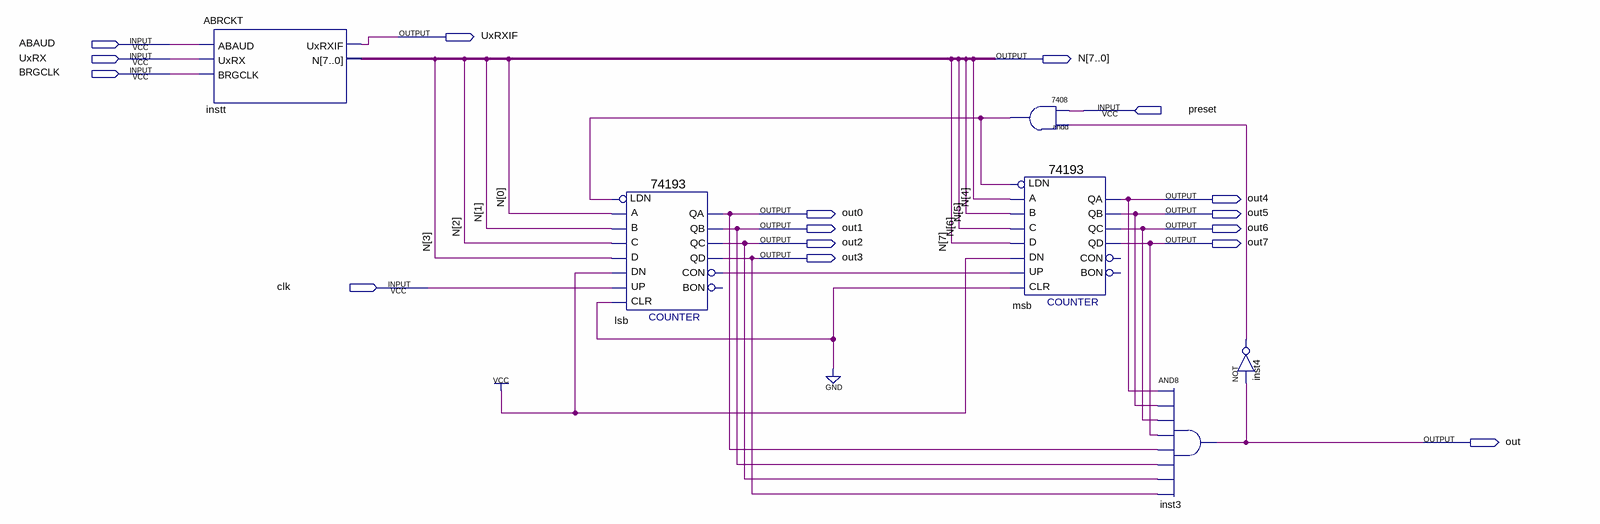
[diagram p0: schematic sheet]
// Quartus schematic BRGCKT (2).bdf as structural Verilog: 6 symbols, 16 pins
module \BRGCKT_(2)  (
  input  ABAUD,
  input  UxRX,
  input  BRGCLK,
  input  preset,
  input  clk,
  output UxRXIF,
  output [7:0] N,
  output out4,
  output out0,
  output out5,
  output out1,
  output out6,
  output out2,
  output out7,
  output out3,
  output out
);

  wire andd_1, inst4_out, lsb_con;

  ABRCKT instt (.ABAUD(ABAUD), .UxRX(UxRX), .BRGCLK(BRGCLK), .UxRXIF(UxRXIF), .N(N));
  \74193  lsb (
    .D(N[3]), .C(N[2]), .B(N[1]), .A(N[0]), .CLR(1'b0), .UP(clk), .DN(1'b1), .LDN(andd_1), .QB(out1),
    .QA(out0), .CON(lsb_con), .QD(out3), .QC(out2));  // open: BON
  \7408  andd (.\3 (inst4_out), .\2 (preset), .\1 (andd_1));
  \74193  msb (
    .D(N[7]), .C(N[6]), .B(N[5]), .A(N[4]), .CLR(1'b0), .UP(lsb_con), .DN(1'b1), .LDN(andd_1), .QB(out5),
    .QA(out4), .QD(out7), .QC(out6));  // open: CON, BON
  and inst3 (out, out4, out5, out6, out7, out0, out1, out2, out3);
  not inst4 (inst4_out, out);
endmodule
